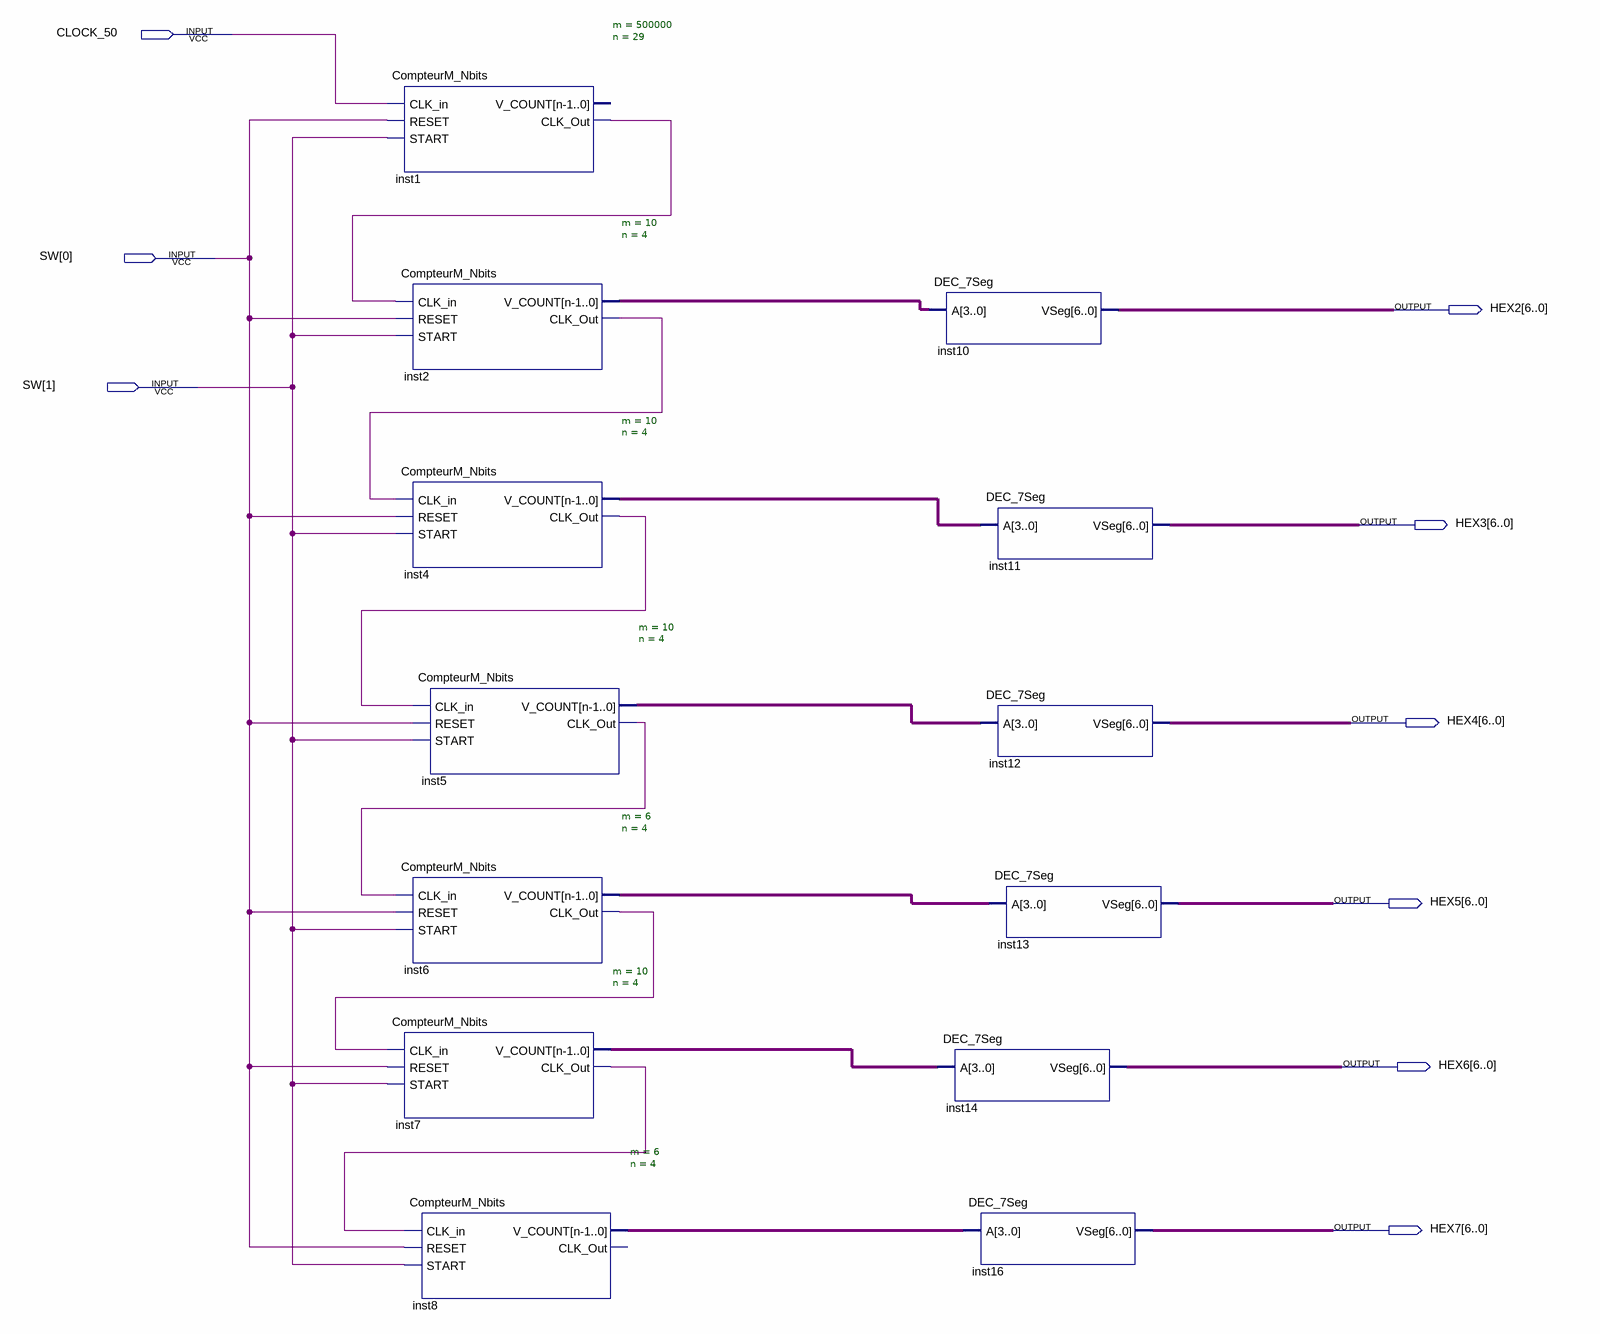
[diagram p0: schematic sheet]
// Quartus schematic chronometreShema2.bdf as structural Verilog: 13 symbols, 9 pins
module chronometreShema2 (
  input  CLOCK_50,
  input  [1:0] SW,
  output [6:0] HEX2,
  output [6:0] HEX3,
  output [6:0] HEX4,
  output [6:0] HEX5,
  output [6:0] HEX6,
  output [6:0] HEX7
);

  wire inst1_clk_out, inst2_clk_out, inst4_clk_out, inst5_clk_out, inst6_clk_out, inst7_clk_out;
  wire [3:0] inst2_v_count, inst4_v_count, inst5_v_count, inst6_v_count, inst7_v_count, inst8_v_count;

  CompteurM_Nbits #(.m(500000), .n(29)) inst1 (
    .CLK_in(CLOCK_50), .RESET(SW[0]), .START(SW[1]), .CLK_Out(inst1_clk_out));  // open: V_COUNT
  CompteurM_Nbits #(.m(10), .n(4)) inst2 (
    .CLK_in(inst1_clk_out), .RESET(SW[0]), .START(SW[1]), .V_COUNT(inst2_v_count), .CLK_Out(inst2_clk_out));
  CompteurM_Nbits #(.m(10), .n(4)) inst4 (
    .CLK_in(inst2_clk_out), .RESET(SW[0]), .START(SW[1]), .V_COUNT(inst4_v_count), .CLK_Out(inst4_clk_out));
  CompteurM_Nbits #(.m(6), .n(4)) inst6 (
    .CLK_in(inst5_clk_out), .RESET(SW[0]), .START(SW[1]), .V_COUNT(inst6_v_count), .CLK_Out(inst6_clk_out));
  CompteurM_Nbits #(.m(10), .n(4)) inst7 (
    .CLK_in(inst6_clk_out), .RESET(SW[0]), .START(SW[1]), .V_COUNT(inst7_v_count), .CLK_Out(inst7_clk_out));
  CompteurM_Nbits #(.m(10), .n(4)) inst5 (
    .CLK_in(inst4_clk_out), .RESET(SW[0]), .START(SW[1]), .V_COUNT(inst5_v_count), .CLK_Out(inst5_clk_out));
  CompteurM_Nbits #(.m(6), .n(4)) inst8 (
    .CLK_in(inst7_clk_out), .RESET(SW[0]), .START(SW[1]), .V_COUNT(inst8_v_count));  // open: CLK_Out
  DEC_7Seg inst10 (.A(inst2_v_count), .VSeg(HEX2));
  DEC_7Seg inst14 (.A(inst7_v_count), .VSeg(HEX6));
  DEC_7Seg inst11 (.A(inst4_v_count), .VSeg(HEX3));
  DEC_7Seg inst12 (.A(inst5_v_count), .VSeg(HEX4));
  DEC_7Seg inst13 (.A(inst6_v_count), .VSeg(HEX5));
  DEC_7Seg inst16 (.A(inst8_v_count), .VSeg(HEX7));
endmodule
